# Altium schematic sheet sdcard.SchDoc
size Letter
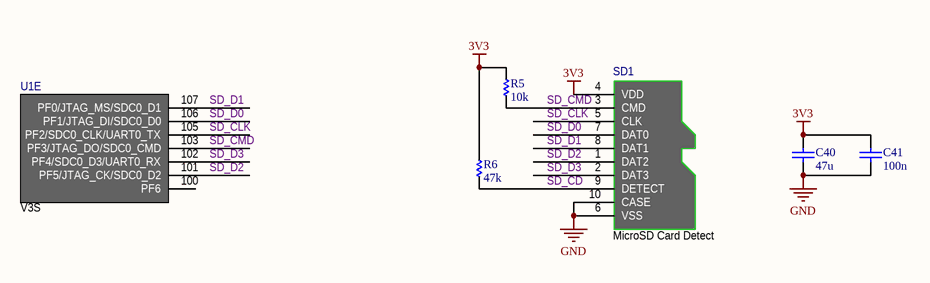
[diagram p0: sdcard.SchDoc]

## Parts
C40  47u  [CAPC2012L]
C41  100n  [CAPC1005N]
R5  10k  [RESC1005N]
R6  47k  [RESC1005N]
SD1  MicroSD Card Detect  [47309-2851]
U1  V3S  [V3S]  (part E of 10)

## Nets
3V3: C40.2 C41.2 R5.2 R6.2 SD1.4(VDD)
GND: C40.1 C41.1 SD1.6(VSS) SD1.10(CASE)
SD_CD: R6.1 SD1.9(DETECT)
SD_CLK: SD1.5(CLK) U1.105(PF2/SDC0_CLK/UART0_TX)
SD_CMD: R5.1 SD1.3(CMD) U1.103(PF3/JTAG_DO/SDC0_CMD)
SD_D0: SD1.7(DAT0) U1.106(PF1/JTAG_DI/SDC0_D0)
SD_D1: SD1.8(DAT1) U1.107(PF0/JTAG_MS/SDC0_D1)
SD_D2: SD1.1(DAT2) U1.101(PF5/JTAG_CK/SDC0_D2)
SD_D3: SD1.2(DAT3) U1.102(PF4/SDC0_D3/UART0_RX)

Not connected (* = marked no-connect by the designer): U1 100(PF6)

## Library data of the parts
C40 C41 = Cap Semi: Capacitor (Semiconductor SIM Model); Published: 8-Jun-2000; LatestRevisionDate: 29-May-2009; LatestRevisionNote: IPC-7351 Footprint Added.; PackageReference: C1206; Publisher: Altium Limited; PackageDescription: Chip Capacitor
  C40: Supplier 1: Digi-Key; Supplier Part Number 1: 490-6469-1-ND
R5 R6 = Res Semi: Semiconductor Resistor; Published: 8-Jun-2000; LatestRevisionDate: 17-Jul-2002; LatestRevisionNote: Re-released for DXP Platform.; PackageReference: AXIAL-0.5; Publisher: Altium Limited; PackageDescription: Axial Device, Thru-Hole; 2 Leads; 0.5 in Pin Spacing
SD1 = MicroSD Card Detect: microSD card memory connector; Supplier 1: Digi-Key; Supplier Part Number 1: WM6701TR-ND